# Altium schematic sheet Sensors.SchDoc
size C; SheetNumber: 3; SheetTotal: 7
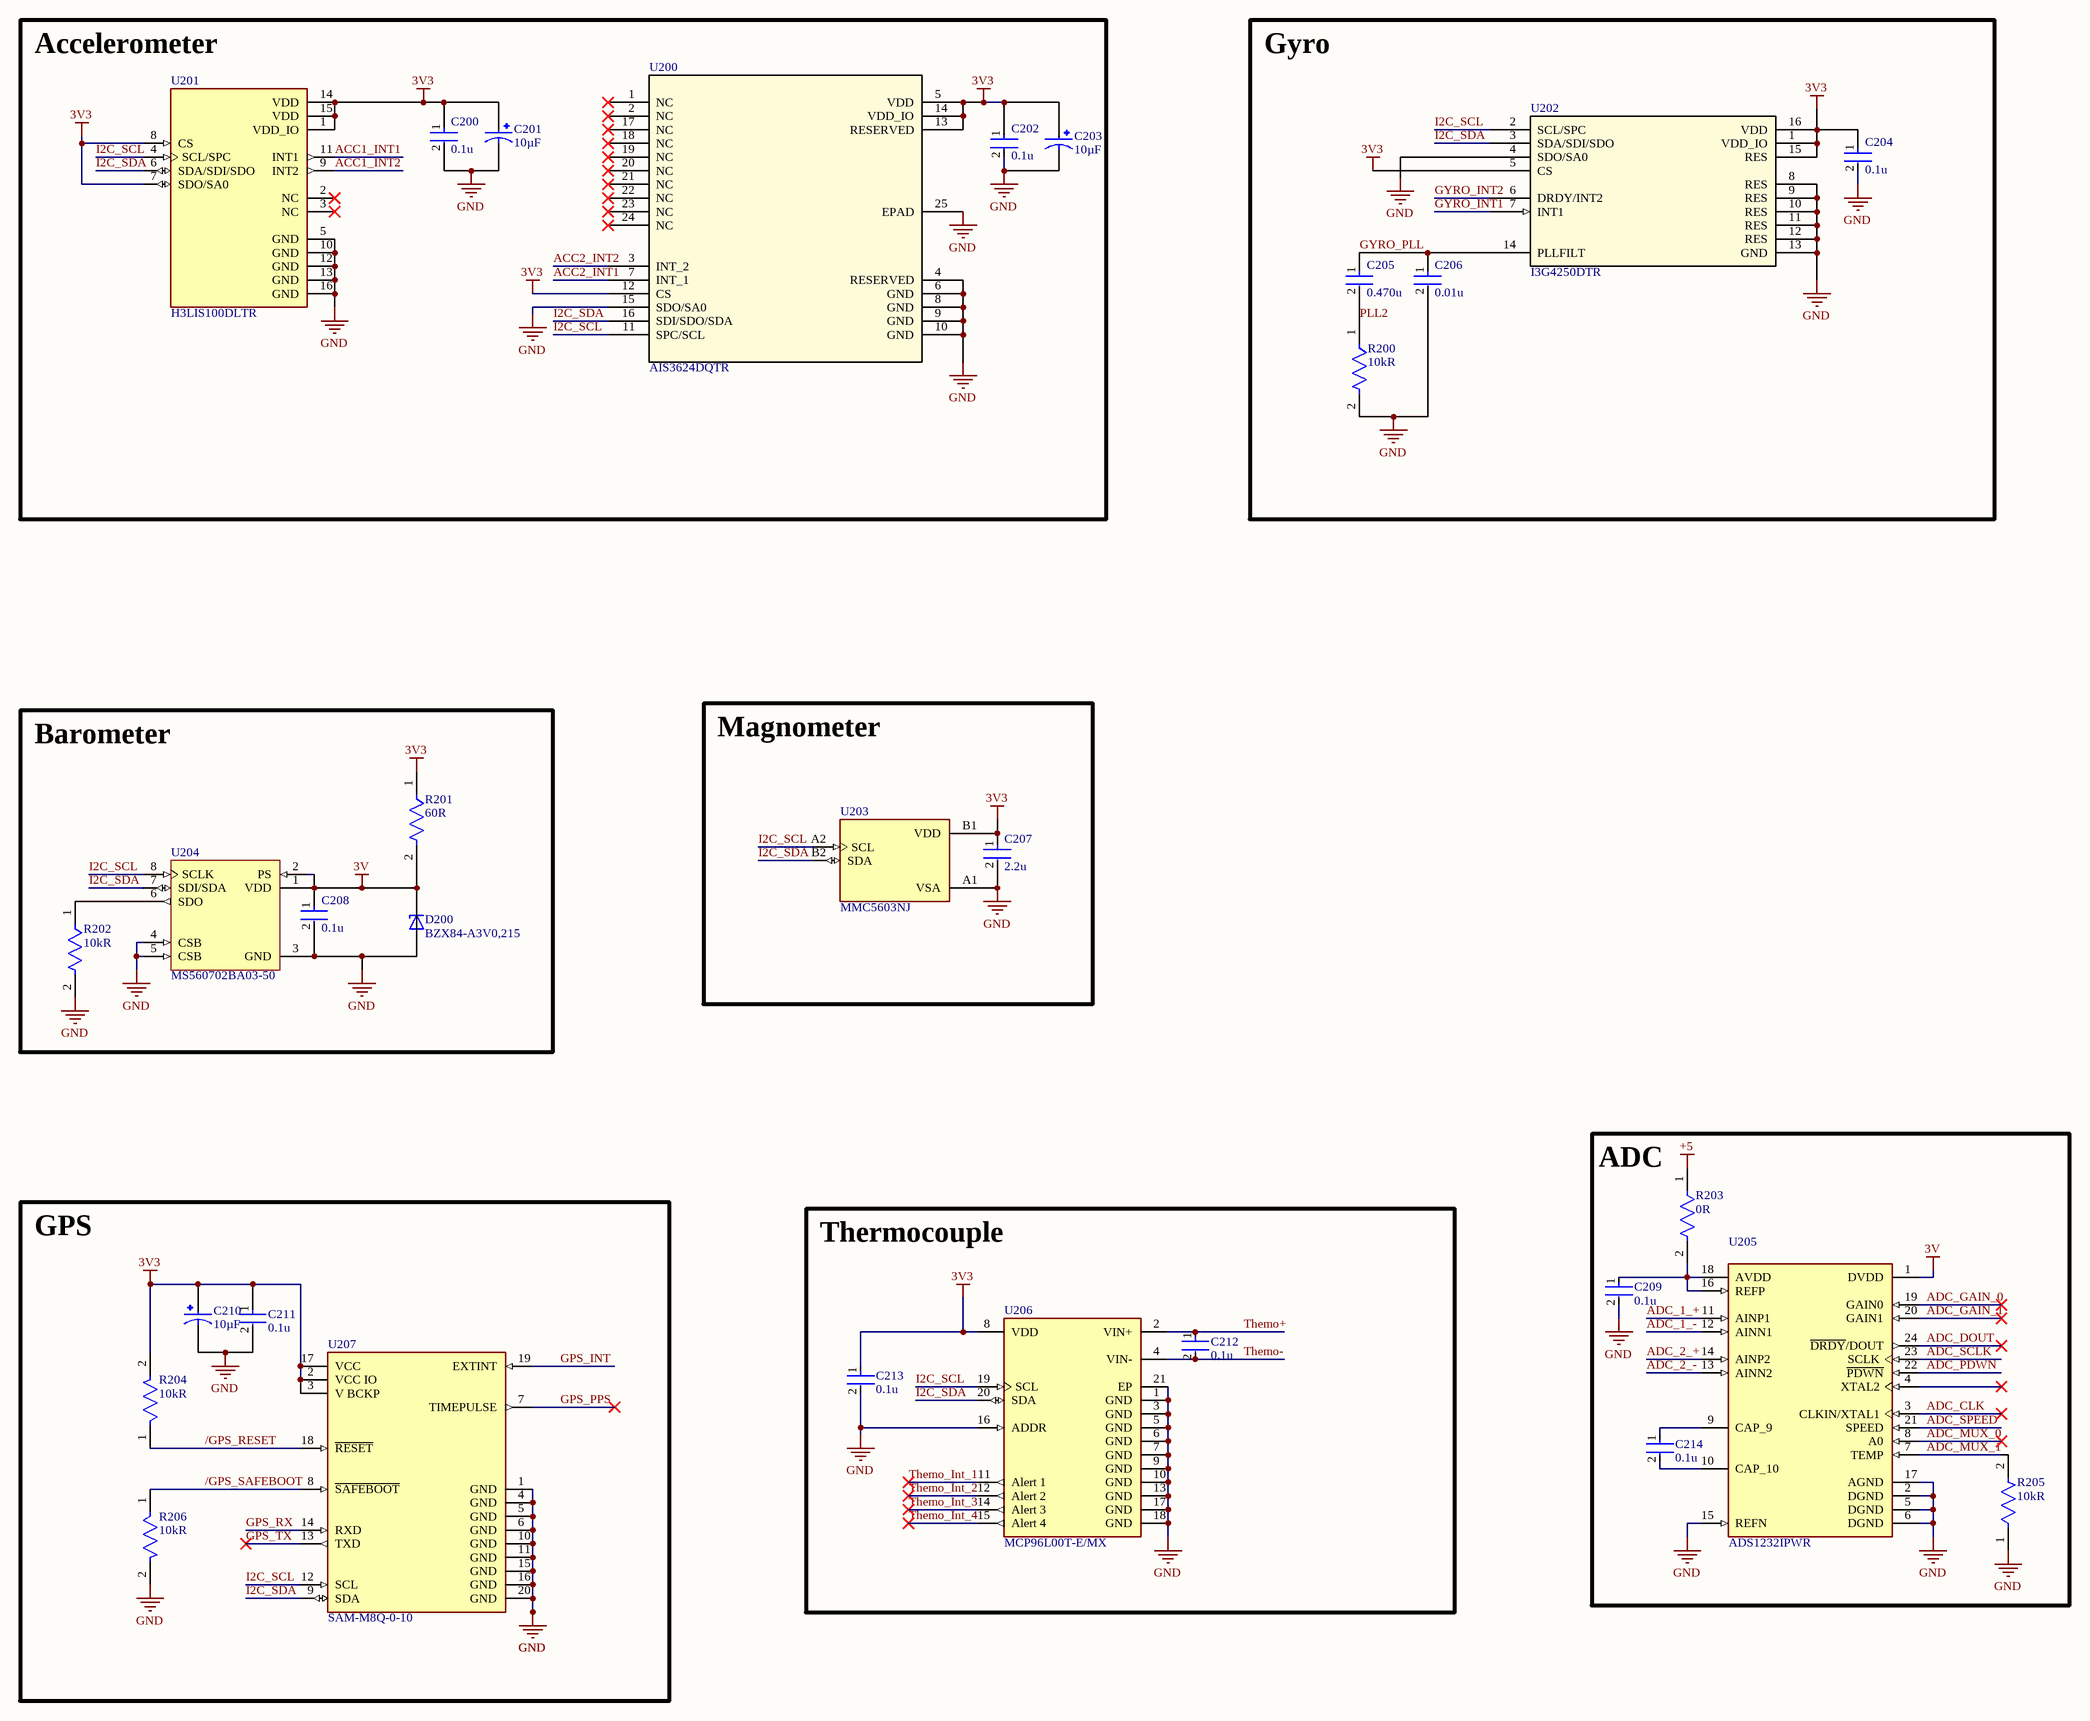
[diagram p0: Sensors.SchDoc]

## Parts
C200  Capacitance: 0.1u  [FP-CL10-IPC_A]  (hidden comment: CL10C681JB8NFNC)
C201  value 10µF  [CAP_EEEFN1C100R]  (hidden comment: EEEFN1C100R)
C202  Capacitance: 0.1u  [FP-CL10-IPC_A]  (hidden comment: CL10C681JB8NFNC)
C203  value 10µF  [CAP_EEEFN1C100R]  (hidden comment: EEEFN1C100R)
C204  Capacitance: 0.1u  [FP-CL10-IPC_A]  (hidden comment: CL10C681JB8NFNC)
C205  Capacitance: 0.470u  [FP-CL10-IPC_A]  (hidden comment: CL10C681JB8NFNC)
C206  Capacitance: 0.01u  [FP-CL10-IPC_A]  (hidden comment: CL10C681JB8NFNC)
C207  Capacitance: 2.2u  [FP-CL10-IPC_A]  (hidden comment: CL10C681JB8NFNC)
C208  Capacitance: 0.1u  [FP-CL10-IPC_A]  (hidden comment: CL10C681JB8NFNC)
C209  Capacitance: 0.1u  [FP-CL10-IPC_A]  (hidden comment: CL10C681JB8NFNC)
C210  value 10µF  [CAP_EEEFN1C100R]  (hidden comment: EEEFN1C100R)
C211  Capacitance: 0.1u  [FP-CL10-IPC_A]  (hidden comment: CL10C681JB8NFNC)
C212  Capacitance: 0.1u  [FP-CL10-IPC_A]  (hidden comment: CL10C681JB8NFNC)
C213  Capacitance: 0.1u  [FP-CL10-IPC_A]  (hidden comment: CL10C681JB8NFNC)
C214  Capacitance: 0.1u  [FP-CL10-IPC_A]  (hidden comment: CL10C681JB8NFNC)
D200  BZX84-A3V0,215  [SOT95P230X110-3N]
R200  value 10kR  [FP-CPF0603-MFG]  (hidden comment: CPF0603B2K15E1)
R201  value 60R  [FP-CPF0603-MFG]  (hidden comment: CPF0603B2K15E1)
R202  value 10kR  [FP-CPF0603-MFG]  (hidden comment: CPF0603B2K15E1)
R203  value 0R  [FP-CPF0603-MFG]  (hidden comment: CPF0603B2K15E1)
R204  value 10kR  [FP-CPF0603-MFG]  (hidden comment: CPF0603B2K15E1)
R205  value 10kR  [FP-CPF0603-MFG]  (hidden comment: CPF0603B2K15E1)
R206  value 10kR  [FP-CPF0603-MFG]  (hidden comment: CPF0603B2K15E1)
U200  AIS3624DQTR  [QFN24L_4X4X0P5_STM]
U201  H3LIS100DLTR  [PQFN50P300X300X100-16N]
U202  I3G4250DTR  [LGA-16_4X4X1_STM]
U203  MMC5603NJ  [XDCR_MMC5603NJ]
U204  MS560702BA03-50  [TECO-MS560702BA03-50_V]
U205  ADS1232IPWR  [SOP65P640X120-24N]
U206  MCP96L00T-E/MX  [FP-C04-186-IPC_C]
U207  SAM-M8Q-0-10  [FP-SAM-M8Q-0-10-MFG]

## Blocks framed on the sheet
Accelerometer: C200-C203 U200 U201
Gyro: C204-C206 R200 U202
Barometer: C208 D200 R201 R202 U204
Magnometer: C207 U203
ADC: C209 C214 R203 R205 U205
GPS: C210 C211 R204 R206 U207
Thermocouple: C212 C213 U206

## Nets
3V: C208.1 D200.3(C) R201.2 U204.1(VDD) U204.2(PS) U205.1(DVDD)
3V3: C200.1 C201.1 C202.1 C203.1 C204.1 C207.1 C210.1 C211.1 C213.1 R201.1 R204.2 U200.5(VDD) U200.12(CS) U200.13(RESERVED) U200.14(VDD_IO) U201.1(VDD_IO) U201.7(SDO/SA0) U201.8(CS) U201.14(VDD) U201.15(VDD) U202.1(VDD_IO) U202.5(CS) U202.15(RES) U202.16(VDD) U203.B1(VDD) U206.8(VDD) U207.2(VCC_IO) U207.3(V_BCKP) U207.17(VCC)
+5: R203.1
GND: C200.2 C201.2 C202.2 C203.2 C204.2 C206.2 C207.2 C208.2 C209.2 C210.2 C211.2 C213.2 D200.1(A) R200.2 R202.2 R205.1 R206.2 U200.4(RESERVED) U200.6(GND) U200.8(GND) U200.9(GND) U200.10(GND) U200.15(SDO/SA0) U200.25(EPAD) U201.5(GND) U201.10(GND) U201.12(GND) U201.13(GND) U201.16(GND) U202.4(SDO/SA0) U202.8(RES) U202.9(RES) U202.10(RES) U202.11(RES) U202.12(RES) U202.13(GND) U203.A1(VSA) U204.3(GND) U204.4(CSB) U204.5(CSB) U205.2(DGND) U205.5(DGND) U205.6(DGND) U205.15(REFN) U205.17(AGND) U206.1(GND) U206.3(GND) U206.5(GND) U206.6(GND) U206.7(GND) U206.9(GND) U206.10(GND) U206.13(GND) U206.16(ADDR) U206.17(GND) U206.18(GND) U206.21(EP) U207.1(GND) U207.4(GND) U207.5(GND) U207.6(GND) U207.10(GND) U207.11(GND) U207.15(GND) U207.16(GND) U207.20(GND)
/GPS_RESET: R204.1 U207.18(~{RESET})
/GPS_SAFEBOOT: R206.1 U207.8(~{SAFEBOOT})
ACC1_INT1: U201.11(INT1)
ACC1_INT2: U201.9(INT2)
ACC2_INT1: U200.7(INT_1)
ACC2_INT2: U200.3(INT_2)
ADC_1_+: U205.11(AINP1)
ADC_1_-: U205.12(AINN1)
ADC_2_+: U205.14(AINP2)
ADC_2_-: U205.13(AINN2)
ADC_CLK: U205.3(CLKIN/XTAL1)
ADC_DOUT: U205.24(~{DRDY}/DOUT)
ADC_GAIN_0: U205.19(GAIN0)
ADC_GAIN_1: U205.20(GAIN1)
ADC_MUX_0: U205.8(A0)
ADC_MUX_1: R205.2 U205.7(TEMP)
ADC_PDWN: U205.22(~{PDWN})
ADC_SCLK: U205.23(SCLK)
ADC_SPEED: U205.21(SPEED)
GPS_INT: U207.19(EXTINT)
GPS_PPS: U207.7(TIMEPULSE)
GPS_RX: U207.14(RXD)
GPS_TX: U207.13(TXD)
GYRO_INT1: U202.7(INT1)
GYRO_INT2: U202.6(DRDY/INT2)
GYRO_PLL: C205.1 C206.1 U202.14(PLLFILT)
I2C_SCL: U200.11(SPC/SCL) U201.4(SCL/SPC) U202.2(SCL/SPC) U203.A2(SCL) U204.8(SCLK) U206.19(SCL) U207.12(SCL)
I2C_SDA: U200.16(SDI/SDO/SDA) U201.6(SDA/SDI/SDO) U202.3(SDA/SDI/SDO) U203.B2(SDA) U204.7(SDI/SDA) U206.20(SDA) U207.9(SDA)
PLL2: C205.2 R200.1
Themo+: C212.1 U206.2(VIN+)
Themo-: C212.2 U206.4(VIN-)
Themo_Int_1: U206.11(Alert_1)
Themo_Int_2: U206.12(Alert_2)
Themo_Int_3: U206.14(Alert_3)
Themo_Int_4: U206.15(Alert_4)
NetC209_1: C209.1 R203.2 U205.16(REFP) U205.18(AVDD)
NetC214_1: C214.1 U205.9(CAP_9)
NetC214_2: C214.2 U205.10(CAP_10)
NetR202_1: R202.1 U204.6(SDO)

Not connected (* = marked no-connect by the designer): U200 1(NC)* 2(NC)* 17(NC)* 18(NC)* 19(NC)* 20(NC)* 21(NC)* 22(NC)* 23(NC)* 24(NC)*; U201 2(NC)* 3(NC)*; U205 4(XTAL2)*

## Library data of the parts
C200 C202 C204-C209 C211-C214 = CMP-13271-001533-1: Cap Ceramic 680pF 50V C0G ±5% Pad SMD 0603 +125°C T/R; Voltage Rating: 50V; Radiation Hardening: No; Length: 0.063inch; Min Operating Temperature: -55°C; Package Quantity: 1; Lead Free: Lead Free; Case Code (Metric): 1608; Thickness: 0.035inch; Width: 0.031inch; Height: 0.8mm; Case/Package: 0603; Tolerance: 5%; Mount: Surface Mount; Dielectric: C0G; Max Operating Temperature: 125°C; Case Code (Imperial): 0603; Packaging: Tape and Reel; Depth: 0.8mm
C201 C203 C210 = CMP-001-00085-1: 10ÂµF 16V Aluminum Electrolytic Capacitors Radial, Can - SMD 1.35Ohm @ 100kHz 2000 Hrs @ 105Â°C; MF: Panasonic; Digi-Key_Part_Number: 10-EEE-FN1C100RCT-ND; Design Item ID: EEEFN1C100R; Check_prices: https://www.snapeda.com/parts/EEEFN1C100R/Panasonic/view-part/5793981/?ref=eda; MP: EEEFN1C100R; Source: EEEFN1C100R.SchLib; Case/Package: RADIAL-2 Panasonic; Component Type: Standard; Pins: 2; SnapEDA_Link: https://www.snapeda.com/parts/EEEFN1C100R/Panasonic/view-part/5793981/?ref=snap
D200 = CMP-004-00034-1: Zener Diode 3 V 250 mW Â±1% Surface Mount TO-236AB; MF: Nexperia; Value: *; Source: BZX84-A3V0,215.SchLib; Case/Package: SOT23-3 Nexperia USA Inc.; Pins: 2; Component Type: Standard; MP: BZX84-A3V0,215; SnapEDA_Link: https://www.snapeda.com/parts/BZX84-C3V0,215/Nexperia/view-part/?ref=snap; Check_prices: https://www.snapeda.com/parts/BZX84-C3V0,215/Nexperia/view-part/?ref=eda; Design Item ID: BZX84-A3V0,215
R200-R206 = CMP-03211-008657-1: RES SMD 2.15KΩ 0.1% 1/16W 0603; Manufacturer: TE Connectivity; Temperature Coefficient: 25ppm/°C; Voltage Rating: 50V; Power Rating: 0.063W; Height: 0.55mm; Series: CPF; ComponentLink2Description: Datasheet; Package: CPF0603; Automotive: No; octopart_url: https://octopart.com/cpf0603b2k15e1-te+connectivity-22739551; Lead Free: Yes; Temperature: -55°C to +155°C; RoHS: TRUE; Ipc Land Pattern Name: RESC15580X45; Temperature Range Low: -55°C; Composition: Thin Film; Device Class L3: Chip SMD Resistors; Category: Res; Octopart: https://octopart.com/cpf0603b2k15e1-te+connectivity-22739551; Resistance: 2.15KΩ; ComponentLink2URL: https://www.te.com/commerce/DocumentDelivery/DDEController?Action=showdoc&DocId=Data+Sheet%7F1773200%7FM%7Fpdf%7FEnglish%7FENG_DS_1773200_M.pdf%7F3-1676481-2; Manufacturer Part Number: CPF0603B2K15E1; packaging: 1k Reel; Tolerance: 0.1%; Temperature Range High: +155°C; Device Class L1: Passive Components; Device Class L2: Resistors
U200 = CMP-045-000000-3: No Description Available; Mfr_Name: STMicroelectronics; Design Item ID: AIS3624DQTR; Source: AIS3624DQTR.SchLib; Type: Type; RefDes: RefDes
U201 = CMP-043-000000-1: Accelerometer X, Y, Z Axis Â±100g 25Hz ~ 200Hz 16-TFLGA (3x3); MF: STMicroelectronics; Package: TFLGA-16 STMicroelectronics; Pin Count: 16; Component Type: Standard; MP: H3LIS100DLTR; Source: H3LIS100DLTR.SchLib; Check_prices: https://www.snapeda.com/parts/H3LIS100DLTR/STMicroelectronics/view-part/?ref=eda; Value: *; Design Item ID: H3LIS100DLTR; SnapEDA_Link: https://www.snapeda.com/parts/H3LIS100DLTR/STMicroelectronics/view-part/?ref=snap
U202 = CMP-051-000001-2: No Description Available; Mfr_Name: STMicroelectronics; Design Item ID: I3G4250DTR; RefDes: RefDes; Source: I3G4250DTR.SchLib; Type: Type
U203 = CMP-069-000000-1: Magnetoresistive Sensor X, Y, Z Axis 4-WLP (0.82x0.82); MF: Memsic Inc.; Price: None; SnapEDA_Link: https://www.snapeda.com/parts/MMC5603NJ/Memsic+Inc./view-part/?ref=snap; Purchase-URL: https://pricing.snapeda.com/search/part/MMC5603NJ/?ref=eda; Availability: In Stock; Design Item ID: MMC5603NJ; Component Type: Standard; Value: *; MP: MMC5603NJ; Check_prices: https://www.snapeda.com/parts/MMC5603NJ/Memsic+Inc./view-part/?ref=eda; Source: MMC5603NJ.SchLib; Package: UFBGA-4 Memsic Inc.; Pin Count: 4
U204 = CMP-010-00024-1: Absolute, 4.35Psi Min, 15.95Psi Max, 0-3V, Rectangular, Surface Mount; Min Supply Voltage: 1.8V; Max Supply Voltage: 3.6V; Sensor Type: PRESSURE SENSOR,PEIZORESISTIVE; Max Operating Temperature: 85°C; Mounting Technology: Surface Mount; Min Operating Temperature: -40°C; RoHS Compliant: Yes
U205 = CMP-019-000000-2: MF: {'manufacturer': u'Texas Instruments'}; Source: ADS1232IPWR.SchLib; Value: *; Availability: Unavailable; Price: None; Package: None; Component Type: Standard; MP: ADS1232IPWR; Pin Count: 24; Design Item ID: ADS1232IPWR
U206 = CMP-06290-000002-1: +/- 4.0C THERMOCOUPLE TO I2C CON; Operating Supply Current: 2.5mA; Mount: Surface Mount; Case/Package: VQFN; Packaging: Tape and Reel; Output Type: I2C; Max Operating Temperature: 125°C; Min Operating Temperature: -40°C
U207 = CMP-207130-000004-3: RF RX GALILEO 1.575GHZ/1.602GHZ; Manufacturer: uBlox; Nominal Supply Current: 9.5-32mA; Sensitivity: -165dBm; Automotive Grade: Grade 3; Max Frequency: 1602MHz; Min Supply Voltage: 2.7V; Max Supply Voltage: 3.6V; Data Rate: 400kbits/s; Interface: I2C,UART,Other; Package: 0; ComponentLink2Description: Datasheet; Octopart: https://octopart.com/sam-m8q-0-10-u-blox-88247750; Temperature Range Low: -40°C; Height: 6.8mm; Category: IC; RoHS: TRUE; Digikey Description: RF RX GALILEO 1.575GHZ/1.602GHZ; Footprint Url: https://www.u-blox.com/sites/default/files/SAM-M8Q_HardwareIntegrationManual_%28UBX-16018358%29.pdf; ComponentLink2URL: https://www.u-blox.com/sites/default/files/SAM-M8Q_DataSheet_%28UBX-16012619%29.pdf; Temperature Range High: +85°C; Device Class L1: Integrated Circuits (ICs); Temperature: -40°C to +85°C; Automotive: Yes; Device Class L2: RF Semiconductors and Devices; Manufacturer Part Number: SAM-M8Q-0-10; Device Class L3: Transceivers; Lead Free: Yes